# EAGLE design USBduino (EAGLE 6.1)
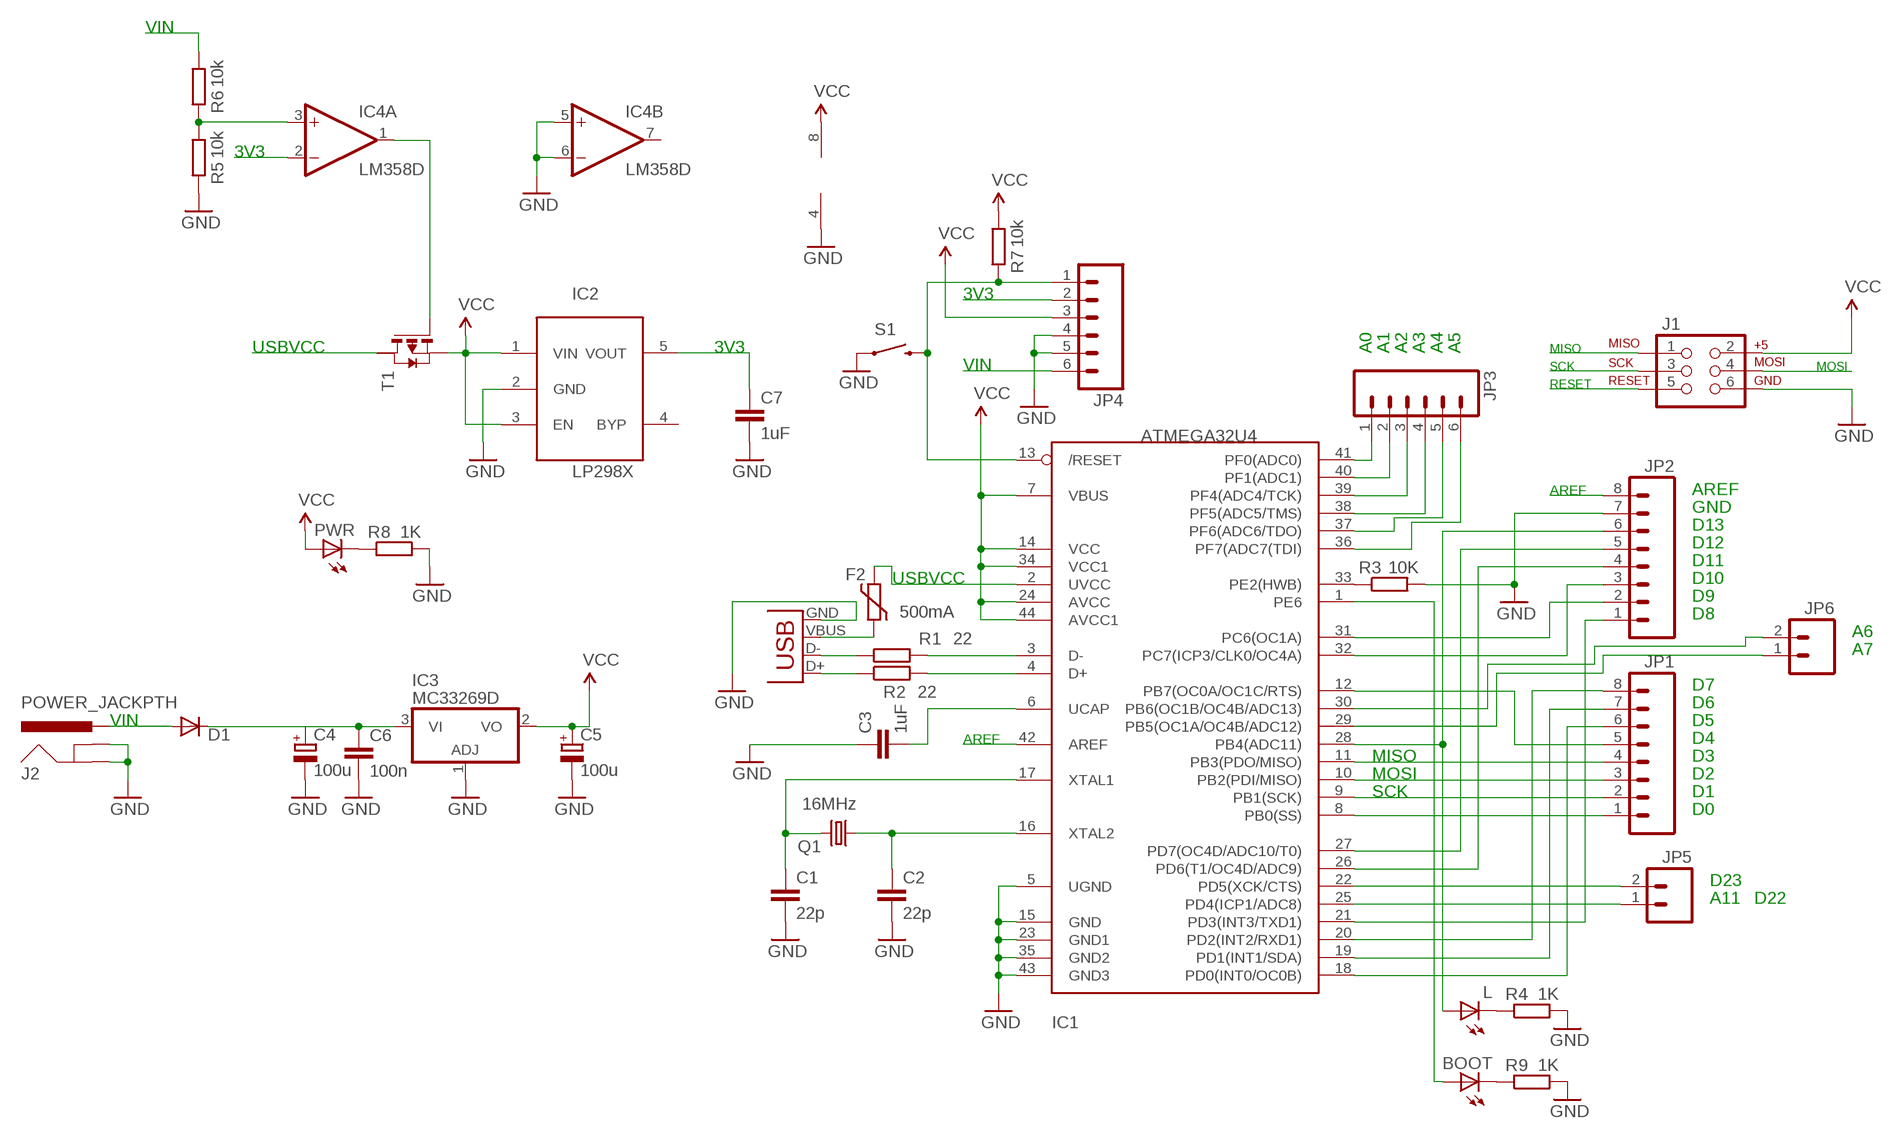
[diagram p0: schematic, sheet 1]

## Parts
BOOT  LED1206  [LED-1206]
C1  22p  C-EUC1206  [C1206]
C2  22p  C-EUC1206  [C1206]
C3  1uF  C-EUC1206  [C1206]
C4  100u  CPOL-EUUD-6,3X8,8  [UD-6,3X5,8_NICHICON]
C5  100u  CPOL-EUUD-6,3X8,8  [UD-6,3X5,8_NICHICON]
C6  100n  C-EUC1206  [C1206]
C7  1uF  C-EUC1206  [C1206]
D1  DIODESMA  [SMA-DIODE]
F2  500mA  1812L  [1812L]
IC1  ATMEGA32U4  ATMEGA32U4-AU  [TQFP44]
IC2  LP2985  LP298XS  [SOT23-5L]
IC3  MC33269D  MC33269D-5.0  [DPACK]
IC4  LM358D  [SO08]
J1  AVR_SPI_PRG_6NS  [2X3-NS]
J2  POWER_JACKPTH  [POWER_JACK_PTH]
JP1  M08  [1X08]
JP2  M08  [1X08]
JP3  M06SIP  [1X06]
JP4  M06SIP  [1X06]
JP5  M02PTH  [1X02]
JP6  M02PTH  [1X02]
L  LED1206  [LED-1206]
PWR  LED1206  [LED-1206]
Q1  16MHz  CRYSTALHC49S  [HC49/S]
R1  22  R-EU_R1206  [R1206]
R2  22  R-EU_R1206  [R1206]
R3  10K  R-EU_R1206  [R1206]
R4  1K  R-EU_R1206  [R1206]
R5  10k  R-EU_R1206  [R1206]
R6  10k  R-EU_R1206  [R1206]
R7  10k  R-EU_R1206  [R1206]
R8  1K  R-EU_R1206  [R1206]
R9  1K  R-EU_R1206  [R1206]
S1  SWITCH-MOMENTARY-2PTH  [TACTILE-PTH]
T1  PMOSSOT223  [SOT223]
X1  USBSMD  [USB-MINIB]

## Nets
3V3: C7.1 IC2.5(VOUT) IC4.2(A:-IN) JP4.2
AREF: IC1.42(AREF) JP2.8
GND: C1.2 C2.2 C3.1 C4.- C5.- C6.2 C7.2 IC1.5(UGND) IC1.15(GND) IC1.23(GND1) IC1.35(GND2) IC1.43(GND3) IC2.2(GND) IC3.1(ADJ) IC4.4(P:V-) IC4.5(B:+IN) IC4.6(B:-IN) J1.6 J2.GND J2.GNDBREAK JP2.7 JP4.4 JP4.5 R3.2 R4.2 R5.1 R8.2 R9.2 S1.1 X1.GND
MISO: IC1.11(PB3(PDO/MISO)) J1.1 JP1.4
MOSI: IC1.10(PB2(PDI/MISO)) J1.4 JP1.3
N$1: IC1.3(D-) R1.2
N$2: IC1.4(D+) R2.2
N$3: R1.1 X1.D-
N$4: R2.1 X1.D+
N$5: C1.1 IC1.17(XTAL1) Q1.2
N$6: C2.1 IC1.16(XTAL2) Q1.1
N$7: IC1.8(PB0(SS)) JP1.1
N$8: IC1.33(PE2(HWB)) R3.1
N$9: L.C R4.1
N$10: IC1.25(PD4(ICP1/ADC8)) JP5.1
N$11: IC1.12(PB7(OC0A/OC1C/RTS)) JP1.5
N$12: IC1.18(PD0(INT0/OC0B)) JP1.6
N$13: IC1.19(PD1(INT1/SDA)) JP1.7
N$14: IC1.20(PD2(INT2/RXD1)) JP1.8
N$15: IC1.21(PD3(INT3/TXD1)) JP2.1
N$16: IC1.31(PC6(OC1A)) JP2.2
N$17: IC1.32(PC7(ICP3/CLK0/OC4A)) JP2.3
N$18: IC1.26(PD6(T1/OC4D/ADC9)) JP2.4
N$19: IC1.27(PD7(OC4D/ADC10/T0)) JP2.5
N$20: IC1.28(PB4(ADC11)) JP2.6 L.A
N$21: IC1.41(PF0(ADC0)) JP3.1
N$22: IC1.40(PF1(ADC1)) JP3.2
N$23: IC1.39(PF4(ADC4/TCK)) JP3.3
N$24: IC1.38(PF5(ADC5/TMS)) JP3.4
N$25: IC1.37(PF6(ADC6/TDO)) JP3.5
N$26: IC1.36(PF7(ADC7(TDI)) JP3.6
N$27: C3.2 IC1.6(UCAP)
N$28: IC4.1(A:OUT) T1.1(G)
N$29: IC1.22(PD5(XCK/CTS)) JP5.2
N$30: IC4.3(A:+IN) R5.2 R6.1
N$31: C4.+ C6.1 D1.C IC3.3(VI)
N$32: F2.P$1 X1.VBUS
N$33: PWR.C R8.1
N$34: IC1.29(PB5(OC1A/OC4B/ADC12)) JP6.1
N$35: IC1.30(PB6(OC1B/OC4B/ADC13)) JP6.2
N$36: BOOT.C R9.1
N$37: BOOT.A IC1.1(PE6)
RESET: IC1.13(/RESET) J1.5 JP4.1 R7.1 S1.3
SCK: IC1.9(PB1(SCK)) J1.3 JP1.2
USBVCC: F2.P$2 IC1.2(UVCC) T1.2(D)
VCC: C5.+ IC1.7(VBUS) IC1.14(VCC) IC1.24(AVCC) IC1.34(VCC1) IC1.44(AVCC1) IC2.1(VIN) IC2.3(EN) IC3.2(VO) IC4.8(P:V+) J1.2 JP4.3 PWR.A R7.2 T1.3(S)
VIN: D1.A J2.PWR JP4.6 R6.2
Unconnected: IC2.4(BYP) IC4.7(B:OUT) T1.4(D2)

## Notes on the sheet
- VIN
- 3V3
- 3V3
- USBVCC | 3V3 | A0 | A1 | A2 | A3 | A4 | A5 | MISO
- VIN | SCK | MOSI
- RESET
- AREF | AREF
- GND
- D13
- D12
- D11
- USBVCC | D10
- D9
- D8
- A6
- A7
- D7
- D6
- VIN | D5
- AREF | D4
- MISO | D3
- MOSI | D2
- SCK | D1
- D0
- D23
- A11 | D22

## Library data of the parts
BOOT L PWR = SparkFun:LED: LEDs Standard schematic elements and footprints for 5mm, 3mm, 1206, and 0603 sized LEDs. 5mm - Spark Fun Electronics SKU : COM-00529 (and others)
C1-C3 C6 C7 = rcl:C-EU: CAPACITOR, European symbol
C4 C5 = rcl:CPOL-EU: POLARIZED CAPACITOR, European symbol
D1 = SparkFun:DIODE: Diode These are standard reverse protection diodes and small signal diodes. SMA package can handle up to about 1A. SOD-323 can handle about 200mA. What the SOD-323 package when ordering, there are some mfgs out there that are 5-pin packages.
F2 = ptc-littlefuse:1812L
IC1 = adafruit:ATMEGA32U4: http://www.ladyada.net/library/eagle
IC2 = adafruit:LP298X
IC3 = linear:MC33269?*: Adjustable Output Low Dropout Voltage Regulator 800 mA Source: http://www.onsemi.com/pub/Collateral/MC33269-D.PDF
IC4 = linear:LM358: OP AMP also LM158; LM258; LM2904 Source: http://cache.national.com/ds/LM/LM158.pdf
J1 = SparkFun:AVR_SPI_PRG_6: AVR ISP 6 Pin This is the reduced ISP connector for AVR programming. Common on Arduino. This footprint will take up less PCB space and can be used with a 10-pin to 6-pin adapter such as SKU: BOB-08508
J2 = SparkFun:POWER_JACK: Power Jack This is the standard 5.5mm barrel jack for power. The PTH is the most common, proven, reliable, footprint. All others are experimental. The Slot footprint only works if the mill layer is transmitted to the PCB fab house so be warned. Spark Fun Electronics SKU : PRT-00119. Mating wall wart : TOL-00298 (and others)
JP1 JP2 = SparkFun:M08: Header 8 Standard 8-pin 0.1" header. Use with straight break away headers (SKU : PRT-00116), right angle break away headers (PRT-00553), swiss pins (PRT-00743), machine pins (PRT-00117), and female headers (PRT-00115).
JP3 JP4 = SparkFun:M06: Header 6 Standard 6-pin 0.1" header. Use with straight break away headers (SKU : PRT-00116), right angle break away headers (PRT-00553), swiss pins (PRT-00743), machine pins (PRT-00117), and female headers (PRT-00115). Molex polarized connector foot print use with SKU : PRT-08094 with associated crimp pins and housings. NOTES ON THE VARIANTS LOCK and LOCK_LONGPADS... This footprint was designed to help hold the alignment of a through-hole component (i.e. 6-pin header) while soldering it into place. You may notice that each hole has been shifted either up or down by 0.005 of an inch from it's more standard position (which is a perfectly straight line). This slight alteration caused the pins (the squares in the middle) to touch the edges of the holes. Because they are alternating, it causes a "brace" to hold the component in place. 0.005 has proven to be the perfect amount of "off-center" position when using our standard breakaway headers. Although looks a little odd when you look at the bare footprint, once you have a header in there, the alteration is very hard to notice. Also, if you push a header all the way into place, it is covered up entirely on the bottom side. This idea of altering the position of holes to aid alignment will be further integrated into the Sparkfun Library for other footprints. It can help hold any component with 3 or more connection pins.
JP5 JP6 = SparkFun:M02: Header 2 Standard 2-pin 0.1" header. Use with straight break away headers (SKU : PRT-00116), right angle break away headers (PRT-00553), swiss pins (PRT-00743), machine pins (PRT-00117), and female headers (PRT-00115). Molex polarized connector foot print use with SKU : PRT-08233 with associated crimp pins and housings.
Q1 = crystal:CRYSTAL: CRYSTAL; OC_FARNELL: 1667008; OC_NEWARK: unknown
R1-R9 = rcl:R-EU_: RESISTOR, European symbol
S1 = SparkFun:SWITCH-MOMENTARY-2
T1 = zetex:PMOSSOT223: MOS FET; OC_FARNELL: unknown; OC_NEWARK: unknown
X1 = SparkFun:USB: USB Connectors USB-B-PTH is fully proven SKU : PRT-00139 USB-miniB is fully proven SKU : PRT-00587 USB-A-PCB is untested. USB-A-H is throughly reviewed, but untested. Spark Fun Electronics SKU : PRT-00437 USB-B-SMT is throughly reviewed, but untested. Needs silkscreen touching up. USB-A-S has not been used/tested USB-MB-H has not been used/tested

## Board
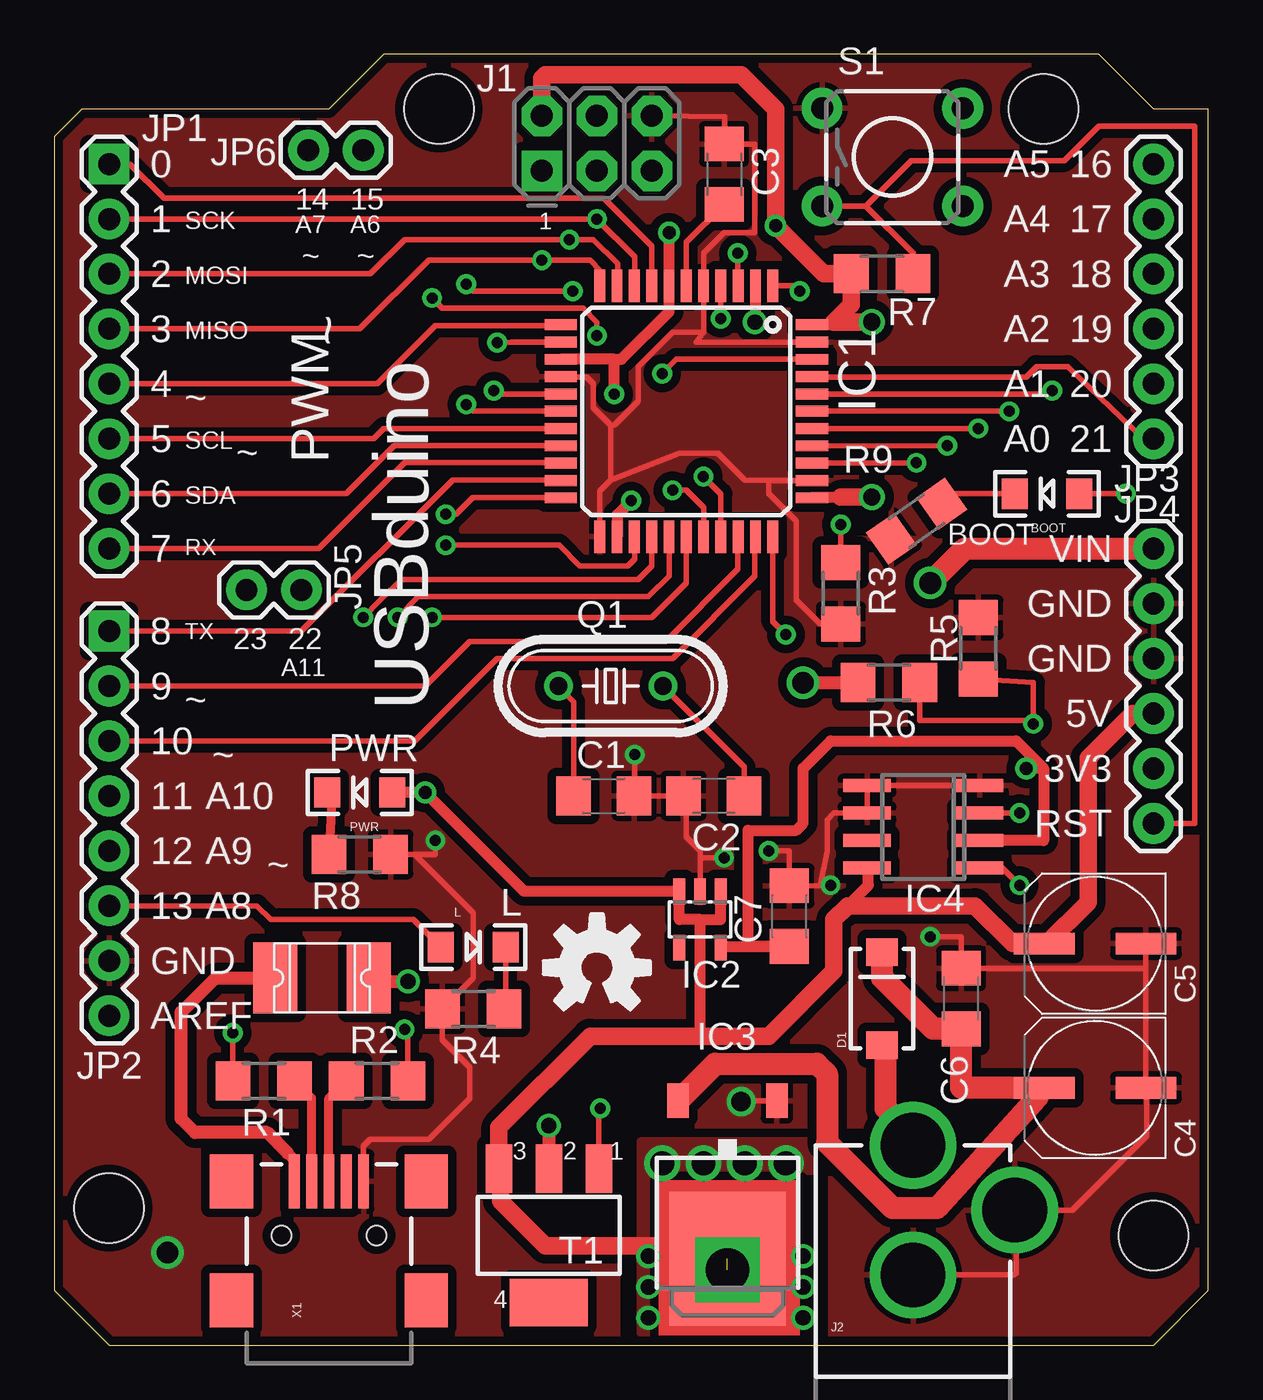
[diagram p1: board, top side]
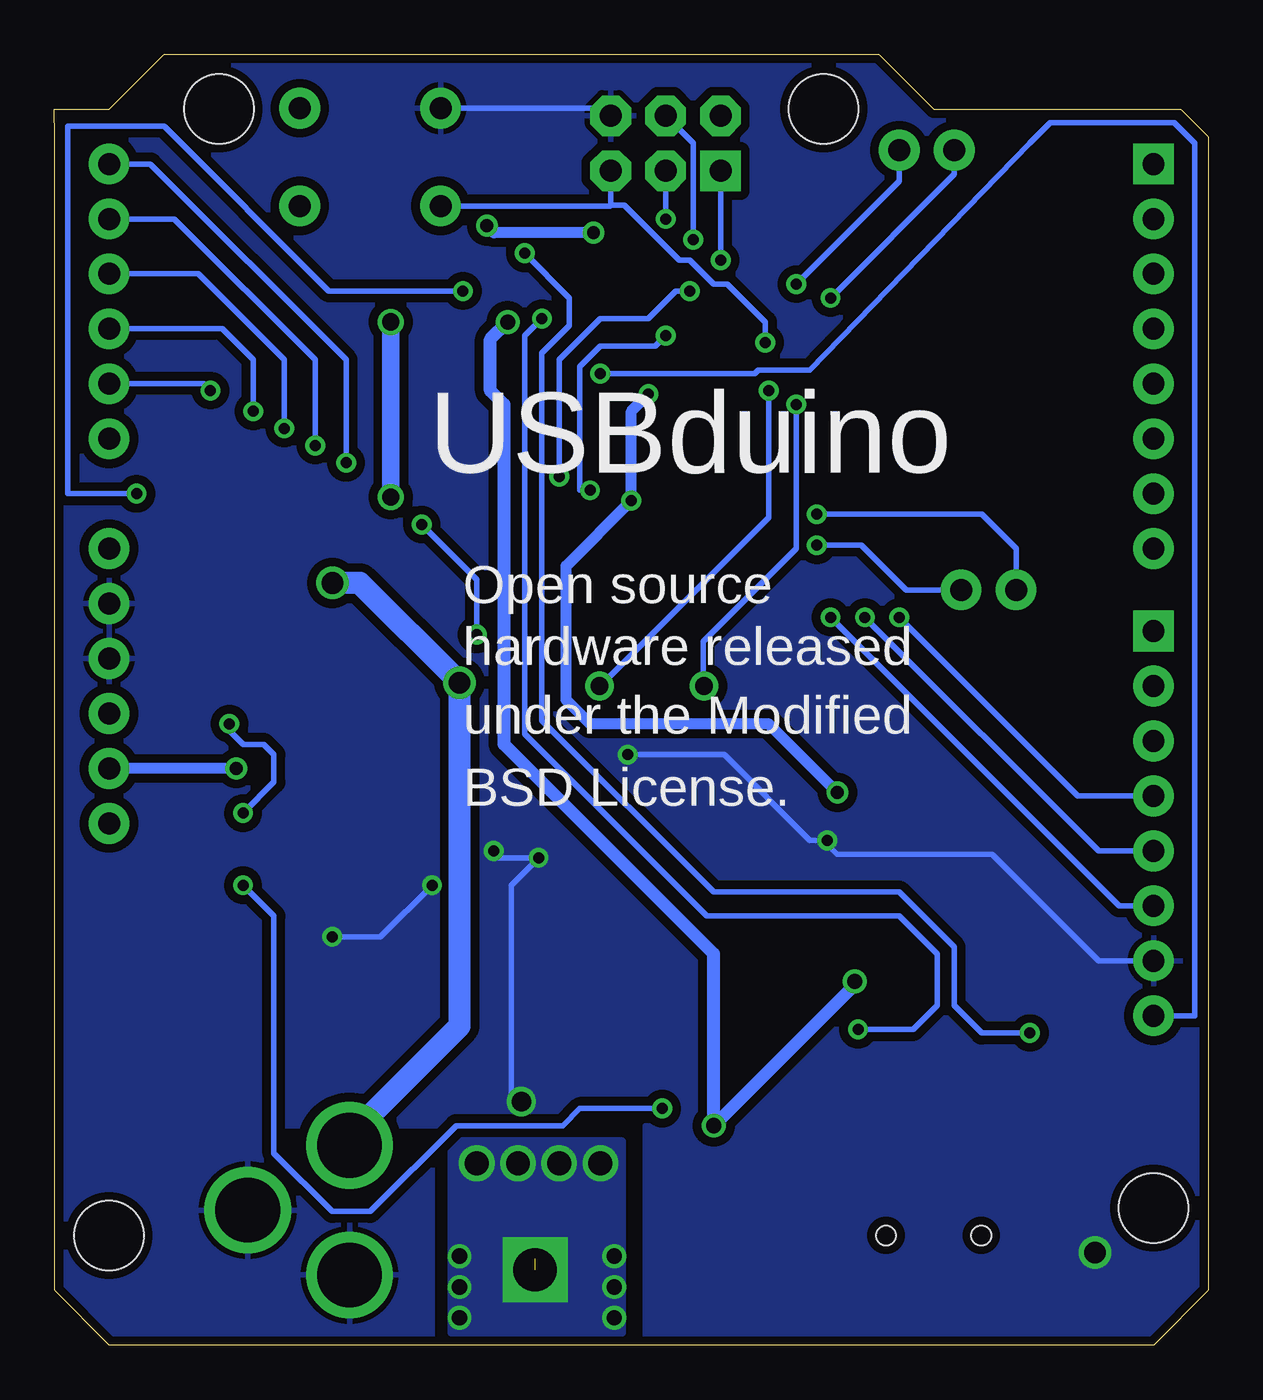
[diagram p2: board, bottom side, seen from below]

Size 53.34 x 59.69 mm. Coordinates in mm from the lower left corner, seen from the top.
Outline: 0,2.54 2.54,0 50.8,0 53.32,2.54 53.32,55.87 53.34,57.15 50.8,57.15 48.26,59.69 15.24,59.69 12.7,57.15 1.27,57.15 0,55.88 0,2.54
Copper layers (1*16): Top 0.035mm / dielectric 1.5mm / Bottom 0.035mm
Design rules: minimum track width 10mil, minimum drill 20mil, track to track 8mil, track to pad 8mil, pad to pad 8mil, via to via 8mil, smd to smd 8mil, copper to edge 10mil, drill to drill 8mil, minimum pad ring 10mil, minimum via ring 8mil, stop-mask expansion 4mil, vias tented up to drill 0mil, thermal gap 10mil
Holes 3.2 mm at 2.54,6.35 50.8,5.08 45.72,57.15 17.78,57.15

### Footprints (pad centres in the part's own frame; a part is rotated, then mirrored left to right if it is on the bottom)
LED-1206 = smd 1.2 x 1.4: A -1.5,0; C 1.5,0
C1206 = smd 1.6 x 1.8: 1 -1.4,0; 2 1.4,0
UD-6,3X5,8_NICHICON = smd 2.8 x 1: + 2.35,0; - -2.35,0
SMA-DIODE = smd 1.27 x 1.47: A -2.15,0; C 2.15,0
1812L = smd 2.03 x 3.3: P$1 -2.16,0; P$2 2.16,0
TQFP44 = smd 1.5 x 0.5: 1 -5.8,4; 2 -5.8,3.2; 3 -5.8,2.4; 4 -5.8,1.6; 5 -5.8,0.8; 6 -5.8,0; 7 -5.8,-0.8; 8 -5.8,-1.6; 9 -5.8,-2.4; 10 -5.8,-3.2; 11 -5.8,-4; 23 5.8,-4; 24 5.8,-3.2; 25 5.8,-2.4; 26 5.8,-1.6; 27 5.8,-0.8; 28 5.8,0; 29 5.8,0.8; 30 5.8,1.6; 31 5.8,2.4; 32 5.8,3.2; 33 5.8,4 | smd 0.5 x 1.5: 12 -4,-5.8; 13 -3.2,-5.8; 14 -2.4,-5.8; 15 -1.6,-5.8; 16 -0.8,-5.8; 17 0,-5.8; 18 0.8,-5.8; 19 1.6,-5.8; 20 2.4,-5.8; 21 3.2,-5.8; 22 4,-5.8; 34 4,5.8; 35 3.2,5.8; 36 2.4,5.8; 37 1.6,5.8; 38 0.8,5.8; 39 0,5.8; 40 -0.8,5.8; 41 -1.6,5.8; 42 -2.4,5.8; 43 -3.2,5.8; 44 -4,5.8
SOT23-5L = smd 0.55 x 1.2: 1 -0.95,-1.3; 2 0,-1.3; 3 0.95,-1.3; 4 0.95,1.3; 5 -0.95,1.3
DPACK = smd 1 x 1.6: 1 -2.28,-4.8; 3 2.28,-4.8 | smd 5.4 x 6.2: 2 0,2.5
SO08 = smd 0.6 x 2.2: 1 -1.905,-2.6; 2 -0.635,-2.6; 3 0.635,-2.6; 4 1.905,-2.6; 5 1.905,2.6; 6 0.635,2.6; 7 -0.635,2.6; 8 -1.905,2.6
2X3-NS = drill 1.016 pad 1.88 square: 1 -2.54,-1.27 | drill 1.016 pad 1.88 octagon: 2 -2.54,1.27; 3 0,-1.27; 4 0,1.27; 5 2.54,-1.27; 6 2.54,1.27
POWER_JACK_PTH = drill 2.997: GND 0,7.7; GNDBREAK 4.7,10.7; PWR 0,13.7
1X08 = drill 1.016 pad 1.88 square: 1 0,0 | drill 1.016 pad 1.88: 2 2.54,0; 3 5.08,0; 4 7.62,0; 5 10.16,0; 6 12.7,0; 7 15.24,0; 8 17.78,0
1X06 = drill 1.016 pad 1.88: 1 0,0; 2 2.54,0; 3 5.08,0; 4 7.62,0; 5 10.16,0; 6 12.7,0
1X02 = drill 1.016 pad 1.88: 1 0,0; 2 2.54,0
HC49/S = drill 0.813: 1 -2.413,0; 2 2.413,0
R1206 = smd 1.6 x 1.803: 1 -1.422,0; 2 1.422,0
TACTILE-PTH = drill 1.016 pad 1.88: 1 -3.251,2.261; 2 3.251,2.261; 3 -3.251,-2.261; 4 3.251,-2.261
SOT223 = smd 1.219 x 2.235: 1 -2.311,-3.099; 2 0,-3.099; 3 2.311,-3.099 | smd 3.6 x 2.2: 4 0,3.099
USB-MINIB = smd 2.5 x 0.5: D+ 2.5,0; D- 2.5,0.8; GND 2.5,-1.6; ID 2.5,-0.8; VBUS 2.5,1.6 | smd 2.5 x 2: GND@1 -3,-4.5; GND@2 -3,4.5; GND@3 2.5,4.5; GND@4 2.5,-4.5 | hole 0.9: 0,2.2; 0,-2.2

### Placement (x,y rotation side)
BOOT  45.88,39.37 180 top
C1  25.4,25.4 0 top
C2  30.48,25.4 180 top
C3  30.96,54.13 270 top
C4  48.1,11.91 180 top
C5  48.1,18.57 180 top
C6  41.91,16.03 90 top
C7  33.97,19.84 90 top
D1  38.26,16.03 90 top
F2  12.38,16.99 0 top
IC1  29.21,43.18 270 top
IC2  29.85,19.69 180 top
IC3  31.12,6.51 180 top
IC4  40.16,23.97 90 top
J1  25.08,55.56 0 top
J2  39.69,-4.45 0 top
JP1  2.54,54.61 270 top
JP2  2.54,33.02 270 top
JP3  50.8,41.91 90 top
JP4  50.8,24.13 90 top
JP5  11.43,34.92 180 top
JP6  11.75,55.25 0 top
L  19.37,18.41 0 top
PWR  14.13,25.56 180 top
Q1  25.72,30.48 180 top
R1  9.68,12.22 180 top
R2  14.92,12.22 0 top
R3  36.35,34.77 270 top
R4  19.37,15.56 180 top
R5  42.7,32.23 270 top
R6  38.58,30.64 180 top
R7  38.26,49.53 180 top
R8  14.13,22.7 0 top
R9  39.85,38.1 215 top
S1  38.73,54.93 0 top
T1  22.86,5.08 180 top
U$2  [OSHW-LOGO-M]  25.08,17.46 0 top
X1  12.7,5.08 90 top

### Tracks (layer width: path | path; a pad name or v marks a point on that pad's centre or on a via)
3V3  (via drill 0.6)
  Top 0.508: IC2.5 30.85,18.44 C7.1 32.2,18.44 32.07,18.57 32.07,23.81 34.29,23.81 34.61,24.13 34.61,26.67 35.88,27.94 44.45,27.94 45.72,26.67 | 45.72,26.67 45.72,23.34 IC4.2 | 45.72,26.67 v44.93,26.67
  Bottom 0.508: v44.93,26.67 JP4.2
AREF  (via drill 0.51)
  Top 0.254: IC1.42 28.75,45.58 v28.1,44.93
  Bottom 0.254: JP2.8 0.63,15.24 0.63,55.56 1.59,56.52 7.3,56.52 8.25,55.56 18.41,45.08 20.8,45.08 20.95,44.93 v28.1,44.93
GND  (via drill 0.51, 0.9, 1)
  Top 0.254: J1.6 30.98,56.8 C3.1 32.38,55.53 32.38,51.44 | 32.38,51.44 30.96,51.44 30.01,50.49 IC1.5 30.01,46.84 | 32.38,51.44 | 30.01,46.84 28.58,46.84 26.99,45.24 26.99,43.66 25.88,42.55 25.72,42.55 | 25.72,42.55 24.92,43.34 24.92,44.45 24.61,44.77 23.42,44.77 IC1.15 | IC1.43 29.67,46.38 30.01,46.84 | IC1.23 25.21,39.5 25.72,40.01 | 25.72,40.01 25.72,42.55 | 29.84,22.54 29.84,22.86 29.21,23.49 29.21,25.27 C2.2 C1.2 26.8,24.9 v26.83,27.3 | 29.84,22.54 IC2.2 29.84,22.54 | J2.GND 44.37,3.25 44.45,3.33 44.45,6.19 J2.GNDBREAK 47.05,6.25 50.48,9.68 50.48,11.88 C4.- 50.45,17.46 | 50.45,17.46 C5.- | C5.- | 50.45,17.46 50.42,17.43 C6.2 41.91,18.89 v40.48,18.89 | IC4.4 IC4.5 IC4.6 36.04,24.61 35.72,24.29 35.72,22.86 35.4,21.27 | 25.72,40.01 28.92,41.25 30.66,41.25 31.91,40.01 IC1.35 33.05,39.98 33.02,39.85 33.02,39.37 34.29,38.1 34.29,34.45 35.4,33.34 R3.2 | 17.62,22.7 | 17.62,22.7 v17.62,23.34 17.62,22.7 | X1.GND 14.29,7.59 14.29,9.21 14.61,9.52 17.3,9.52 19.21,11.43 19.21,12.86 17.95,14.12 R4.2 19.37,16.98 19.37,20 16.67,22.7 R8.2 17.62,22.7 | 35.4,21.27 34.1,21.24 C7.2 33.97,22.86 v33.02,22.86 | 35.4,21.27 v35.88,21.27 | IC3.1 32.26,11.31 v31.75,11.27 | 29.84,22.54 v30.96,22.54 29.84,22.54
  Bottom 0.254: S1.1 27.98,57.19 J1.6 | JP2.7 5.08,17.78 10,22.7 17.14,22.7 17.62,23.18 v17.62,23.34 18.41,23.34 22.38,27.3 v26.83,27.3 | v40.48,18.89 38.26,18.89 v35.88,21.27 | v31.75,11.27 32.23,11.27 32.23,21.27 v30.96,22.54 33.02,22.54 v33.02,22.86
  other vias: 5.24,4.29
  pour Top (isolate 0.406): 12.7,56.99 1.27,56.99 0.16,55.88 0.16,10.16 0.32,10.16 52.23,10.16 53.18,10.16 53.18,56.99 50.8,56.99 48.26,59.53 15.24,59.53
  pour Bottom (isolate 0.406): 1.27,56.99 1.27,56.99 0.16,55.88 0.16,10.16 52.23,10.16 53.18,10.16 53.18,56.99 50.8,56.99 48.26,59.53 15.24,59.53 12.7,56.99
  pour Top (isolate 0.406): 53.18,10.16 53.18,2.54 50.8,0.16 35.88,0.16 35.88,10.16
  pour Bottom (isolate 0.406): 53.18,10.16 53.18,2.54 50.8,0.16 35.88,0.16 35.88,10.16
  pour Bottom (isolate 0.406): 0.16,10.16 0.16,2.54 2.54,0.16 26.04,0.16 26.04,10.16
  pour Top (isolate 0.406): 0.16,10.16 0.16,2.54 2.54,0.16 26.04,0.16 26.04,10.16
MISO  (via drill 0.51)
  Top 0.254: JP1.4 14.13,46.99 17.3,50.17 v22.54,50.17 24.77,50.17 25.24,49.69 25.24,49.01 IC1.11
  Bottom 0.254: v22.54,50.17 J1.1
MOSI  (via drill 0.51)
  Top 0.254: JP1.3 14.61,49.53 16.19,51.12 23.97,51.12 | 23.97,51.12 24.92,51.12 26.04,50.01 26.04,49 IC1.10 | 23.97,51.12 v23.81,51.12
  Bottom 0.254: J1.4 23.81,55.56 v23.81,51.12
N$1  (via drill 0.51)
  Top 0.254: R1.2 v8.25,14.45 | v31.59,50.48 31.59,49 IC1.3
  Bottom 0.254: v8.25,14.45 10.48,14.45 11.75,15.72 11.75,18.41 14.29,20.95 22.86,20.95 30.8,28.89 30.8,45.88 29.53,47.15 29.53,48.42 v31.59,50.48
N$2  (via drill 0.51)
  Top 0.254: R2.2 16.34,14.45 v16.19,14.61 | IC1.4 30.81,47.64 v30.8,47.47
  Bottom 0.254: v16.19,14.61 13.65,14.61 12.54,15.72 12.54,18.1 14.29,19.84 23.18,19.84 31.59,28.26 31.59,46.67 v30.8,47.47
N$3
  Top 0.406: X1.D- 11.9,11.43 R1.1
N$4
  Top 0.406: X1.D+ 12.7,11.42 R2.1
N$5  (via drill 0.51)
  Top 0.254: IC1.17 19.37,43.18 v19.05,43.5 | C1.1 24,29.75 Q1.2
  Bottom 0.254: Q1.2 23.34,30.48 23.34,32.54 19.05,36.83 v19.05,43.5
N$6  (via drill 0.51)
  Top 0.254: IC1.16 20.47,43.98 v20.32,44.13 | C2.1 31.88,26.73 Q1.1
  Bottom 0.254: Q1.1 28.1,30.48 20.32,38.26 v20.32,44.13
N$7
  Top 0.254: JP1.1 3.49,54.61 5.08,53.02 25.4,53.02 27.62,50.8 27.62,48.99 IC1.8
N$8  (via drill 0.51)
  Top 0.254: IC1.33 33.21,33.47 v33.81,32.86 | v36.35,37.94 R3.1 | R3.1
  Bottom 0.254: v33.81,32.86 33.81,35.4 v36.35,37.94
N$9
  Top 0.254: L.C 20.87,15.64 R4.1
N$10  (via drill 0.51)
  Top 0.254: v18.1,36.99 23.34,36.99 24.29,36.04 26.51,36.04 26.83,36.35 26.83,37.36 IC1.25
  Bottom 0.254: JP5.1 13.97,34.92 16.03,36.99 v18.1,36.99
N$11
  Top 0.254: JP1.5 14.92,44.45 17.62,47.15 23.38,47.15 IC1.12
N$12
  Top 0.254: JP1.6 14.76,41.91 15.24,42.39 IC1.18
N$13
  Top 0.254: JP1.7 13.49,39.37 15.72,41.59 23.4,41.59 IC1.19
N$14
  Top 0.254: JP1.8 12.22,36.83 16.19,40.8 23.39,40.8 IC1.20
N$15
  Top 0.254: JP2.1 11.43,33.02 18.41,40.01 23.38,40.01 IC1.21
N$16
  Top 0.254: JP2.2 17.14,30.48 19.21,32.54 28.26,32.54 31.59,35.88 31.59,37.36 IC1.31
N$17
  Top 0.254: JP2.3 16.67,27.94 20.48,31.75 28.58,31.75 32.38,35.56 32.38,37.36 IC1.32
N$18  (via drill 0.51)
  Top 0.254: v14.29,33.66 15.08,34.45 16.03,35.4 26.99,35.4 27.62,36.04 27.62,37.37 IC1.26
  Bottom 0.254: JP2.4 6.03,25.4 v14.29,33.66
N$19  (via drill 0.51)
  Top 0.254: v15.88,33.66 16.83,34.61 27.46,34.61 28.42,35.56 IC1.27
  Bottom 0.254: JP2.5 5.08,22.86 v15.88,33.66
N$20  (via drill 0.51)
  Top 0.254: v17.46,33.66 27.62,33.66 29.21,35.24 IC1.28 | JP2.6 9.37,20.32 10,19.69 16.6,19.69 L.A
  Bottom 0.254: JP2.6 4.13,20.32 v17.46,33.66
N$21
  Top 0.254: JP3.1 50.32,41.91 46.83,45.24 45.4,45.24 44.93,44.77 35.02,44.77 IC1.41
N$22  (via drill 0.51)
  Top 0.254: IC1.40 45.88,43.98 46.04,44.13 v46.12,44.13
  Bottom 0.254: JP3.2 46.44,44.45 v46.12,44.13
N$23  (via drill 0.51)
  Top 0.254: IC1.39 v44.13,43.18
  Bottom 0.254: JP3.3 45.56,46.99 44.13,45.56 v44.13,43.18
N$24  (via drill 0.51)
  Top 0.254: v42.7,42.39 IC1.38
  Bottom 0.254: JP3.4 46.67,49.53 42.7,45.56 v42.7,42.39
N$25  (via drill 0.51)
  Top 0.254: IC1.37 35.26,41.58 v41.27,41.59 | v41.27,41.59
  Bottom 0.254: JP3.5 47.78,52.07 41.27,45.56 v41.27,41.59
N$26  (via drill 0.51)
  Top 0.254: IC1.36 39.83,40.78 v39.85,40.8
  Bottom 0.254: JP3.6 48.9,54.61 39.85,45.56 v39.85,40.8
N$27
  Top 0.254: IC1.6 29.21,50.99 C3.2
N$28  (via drill 0.51)
  Top 0.254: T1.1 25.17,10.88 v25.24,10.95 | IC4.1 43.81,22.07 v44.61,21.27
  Bottom 0.254: v25.24,10.95 29.05,10.95 29.84,10.16 34.77,10.16 38.73,6.19 40.48,6.19 43.18,8.89 43.18,19.84 v44.61,21.27
N$29  (via drill 0.51)
  Top 0.254: IC1.22 19.34,39.18 18.57,38.42 v18.1,38.42
  Bottom 0.254: JP5.2 8.89,36.83 10.48,38.42 v18.1,38.42
N$30  (via drill 0.51)
  Top 0.254: R6.1 40,28.9 40.01,28.89 45.24,28.89 | 45.24,28.89 45.24,30.63 R5.2 | v45.24,28.73 45.24,28.89 | IC4.3 v44.61,24.61
  Bottom 0.254: v45.24,28.73 45.24,28.42 44.61,27.78 43.66,27.78 43.18,27.3 43.18,26.04 v44.61,24.61
N$31
  Top 0.254: 45.43,11.46 C4.+
  Top 1.016: C4.+ 41.91,11.91 C6.1 40.61,14.63 38.26,16.99 D1.C | 45.43,11.46 40.8,6.35 38.73,6.35 35.72,9.37 35.72,12.54 35.24,13.02 30.54,13.02 IC3.3
N$32
  Top 0.508: X1.VBUS 11.1,8.59 10.8,8.89
  Top 0.61: 10.8,8.89 9.84,9.84 6.51,9.84 5.87,10.48 5.87,15.4 7.46,16.99 F2.P$1
N$33
  Top 0.406: R8.1 12.87,25.48 PWR.C
N$34  (via drill 0.51)
  Top 0.254: IC1.29 30.01,38.73 29.21,39.53 v28.58,39.53 | v25.08,46.67 25.08,47.31 24.45,47.94 17.94,47.94 v17.46,48.42
  Bottom 0.254: v28.58,39.53 29.05,39.53 29.05,45.24 28.1,46.2 25.56,46.2 v25.08,46.67 | JP6.1 11.75,54.13 v17.46,48.42
N$35  (via drill 0.51)
  Top 0.254: IC1.30 30.81,39.36 v30,40.16 | v23.97,48.74 19.37,48.74 v19.05,49.05
  Bottom 0.254: v30,40.16 30,45.56 28.58,46.99 | 28.58,46.99 | 28.58,46.99 28.1,47.47 25.88,47.47 24.61,48.74 v23.97,48.74 | JP6.2 14.29,53.82 v19.05,49.05
N$36
  Top 0.254: BOOT.C 41.62,39.37 R9.1
N$37  (via drill 0.51)
  Top 0.254: IC1.1 34.2,48.98 v34.45,48.74 | v49.53,39.37 BOOT.A
  Bottom 0.254: v34.45,48.74 40.64,48.74 48.26,56.36 52.71,56.36 52.71,39.37 v49.53,39.37
RESET  (via drill 0.51)
  Top 0.254: IC1.13 21.14,46.38 v20.48,46.36 | S1.3 37.5,52.67 | 37.5,52.67 39.69,50.48 R7.1 | JP4.1 52.71,24.13 52.71,56.36 48.26,56.36 46.67,54.77 39.6,54.77 37.5,52.67
  Bottom 0.254: 27.62,52.7 | 27.62,52.7 J1.5 | v20.48,46.36 | v20.48,46.36 20.48,47.31 22.23,49.05 22.38,49.05 | 22.38,49.05 | 22.38,49.05 22.86,49.05 23.97,50.17 24.45,50.17 26.99,52.7 27.62,52.7 | S1.3 27.66,52.67 27.62,52.7
SCK  (via drill 0.51)
  Top 0.254: JP1.2 v25.08,52.07 | v25.08,52.07 26.83,50.32 26.83,49 IC1.9 | v25.08,52.07
  Bottom 0.254: v25.08,52.07 J1.3
USBVCC  (via drill 0.7)
  Top 0.508: IC1.2 32.41,47.33 v32.38,47.31
  Top 0.61: F2.P$2 15.4,16.83 v16.35,16.83 | v22.86,10.16 T1.2
  Bottom 0.61: v16.35,16.83 16.19,16.83 v22.86,10.16 22.86,18.1 32.54,27.78 32.54,43.5 33.18,44.13 33.18,46.51 v32.38,47.31
VCC  (via drill 0.51, 0.6, 0.7, 0.8, 1.1, 2)  (1 unrouted)
  Top 0.254: IC1.7
  Top 0.508: IC1.44 35.91,47.18 36.04,47.31 | IC1.34 36.32,39.18 36.35,39.21 | 37.62,21.91 37.62,22.01 IC4.8 37.56,21.97 37.62,21.91 | 37.62,21.91 37.62,21.27 36.67,20.32 | 29.84,19.69 28.89,19.69 28.9,19.69 IC2.3 21.72,20.98 v17.14,25.56 PWR.A | 30.8,19.69 IC2.1 30.8,19.69 | 29.84,19.69 30.8,19.69 | 29.84,14.29 29.84,19.69 | 25.88,45.58 IC1.14 | 25.88,45.58 26.21,45.58 28.42,47.78 IC1.7 | IC1.24 26.01,38.39 v26.67,39.05 | v25.88,43.97 25.88,45.58 | v33.34,51.75 | v28.42,51.44 IC1.7
  Top 0.813: J1.2 22.54,58.58 22.7,58.74 31.75,58.74 33.34,57.15 v33.34,51.75 35.56,49.53 R7.2 | R7.2 | R7.2 36.84,48.11 36.04,47.31 v37.78,47.31 | v37.78,39.21 36.35,39.21 | IC3.2 28.85,4.01 28.26,4.6 22.7,4.6 20.64,6.67 20.64,8.09 T1.3 20.55,10.07 24.77,14.29 29.84,14.29 33.02,14.29 36.04,17.3 36.04,19.69 36.67,20.32 42.55,20.32 44.29,18.57 C5.+ 45.88,18.57 47.78,20.48 47.78,27.15 49.85,29.21 JP4.3
  Bottom 0.254: v25.88,43.97
  Bottom 0.508: v25.88,43.97 26.67,43.18 v26.67,39.05 29.69,36.04 29.69,29.84 28.58,28.73 20.32,28.73 v17.14,25.56 | v33.34,51.75 33.02,51.44 v28.42,51.44
  Bottom 0.813: v37.78,47.31 v37.78,39.21
  other vias: 28.1,8.41 30,8.41 31.91,8.41 33.81,8.41 31.12,3.49 27.46,4.13 27.46,2.7 27.46,1.27 34.61,4.13 34.61,2.7 34.61,1.27
  pour Top (isolate 0.406): 27.15,0.64 34.92,0.64 34.92,9.37 27.15,9.37
  pour Bottom (isolate 0.406): 34.92,0.64 27.15,0.64 27.15,9.37 34.92,9.37
VIN  (via drill 1)
  Top 0.61: v34.61,30.64 R6.2
  Top 0.813: 38.42,13.73 D1.A
  Top 1.016: J2.PWR 39.69,9.68 38.42,10.95 38.42,13.73 | JP4.6 42.07,36.83 v40.48,35.24
  Bottom 1.016: v40.48,35.24 39.21,35.24 v34.61,30.64 34.61,14.76 39.61,9.76 39.61,9.33 J2.PWR
(copper drawn outside any net)
  shapes: Top area x1

### Text on the board
tPlace: A5 | 16 | 0 | 14 | 15 | A4 | 17 | A7 | A6 | 1 | SCK | 1 | ~ | ~ | A3 | 18 | 2 | MOSI | A2 | 19 | 3 | MISO | ~ | A1 | 20 | 4 | ~ | A0 | 21 | 5 | SCL | ~ | PWM | 6 | SDA | BOOT | VIN | 7 | RX | GND | 23 | 22 | 8 | TX | A11 | GND | 9 | 5V | ~ | USBduino | 10 | ~ | PWR | 3V3 | 11 | A10 | RST | 12 | A9 | ~ | 13 | A8 | L | GND | AREF
bPlace: USBduino | Open source | hardware released | under the Modified | BSD License.